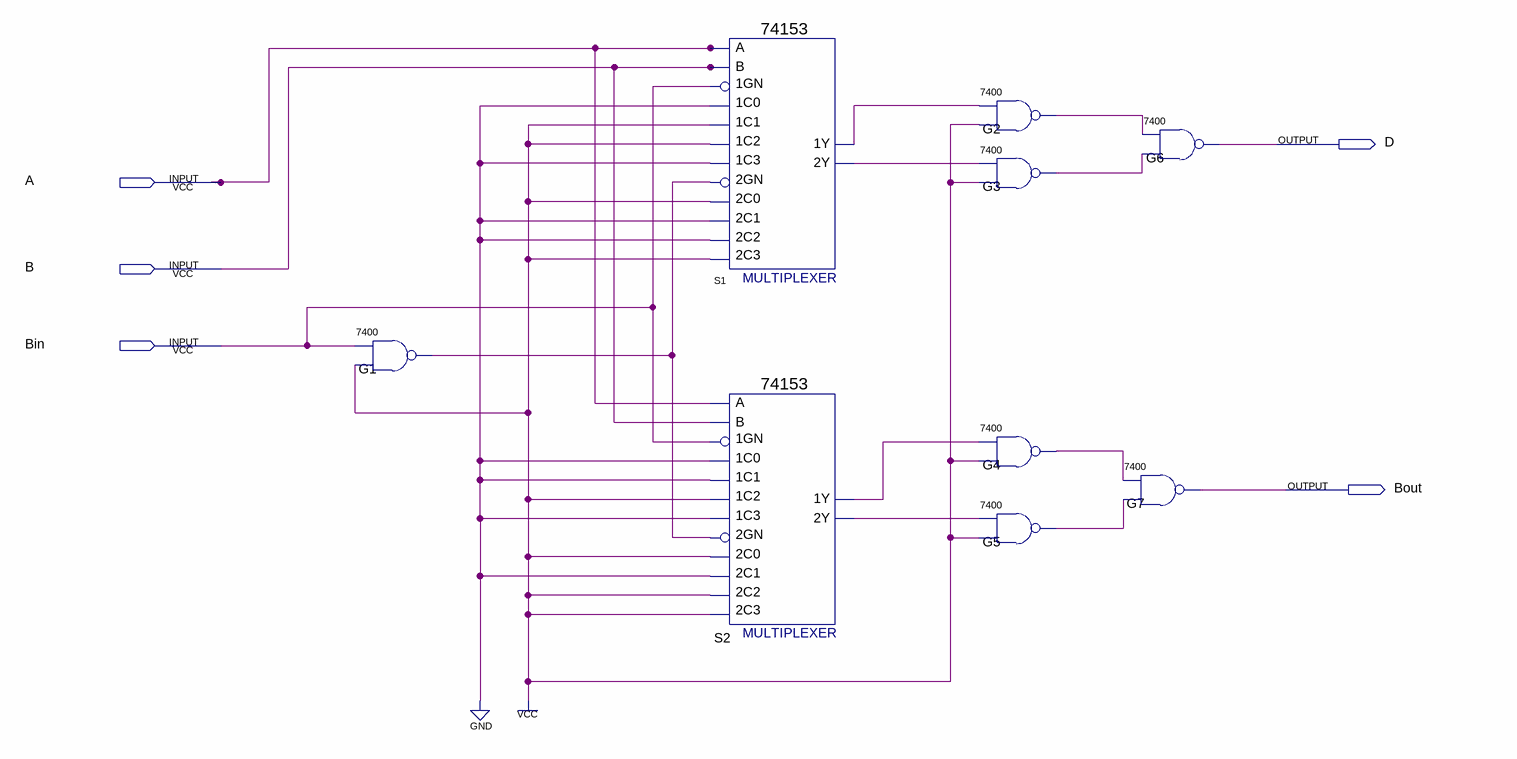
[diagram p0: schematic sheet]
// Quartus schematic 2_2.bdf as structural Verilog: 9 symbols, 5 pins
module \2_2  (
  input  A,
  input  B,
  input  Bin,
  output D,
  output Bout
);

  wire G1_1, G2_1, G3_1, G4_1, G5_1, S1_1y, S1_2y, S2_1y, S2_2y;

  \7400  G1 (.\3 (1'b1), .\2 (Bin), .\1 (G1_1));
  \74153  S1 (
    .\1C1 (1'b1), .\1GN (Bin), .\1C0 (1'b0), .\2C0 (1'b1), .\2GN (G1_1), .\2C2 (1'b0), .\1C2 (1'b1),
    .\1C3 (1'b0), .B(B), .A(A), .\2C1 (1'b0), .\2C3 (1'b1), .\1Y (S1_1y), .\2Y (S1_2y));
  \74153  S2 (
    .\1C1 (1'b0), .\1GN (Bin), .\1C0 (1'b0), .\2C0 (1'b1), .\2GN (G1_1), .\2C2 (1'b1), .\1C2 (1'b1),
    .\1C3 (1'b0), .B(B), .A(A), .\2C1 (1'b0), .\2C3 (1'b1), .\1Y (S2_1y), .\2Y (S2_2y));
  \7400  G2 (.\3 (1'b1), .\2 (S1_1y), .\1 (G2_1));
  \7400  G3 (.\3 (1'b1), .\2 (S1_2y), .\1 (G3_1));
  \7400  G4 (.\3 (1'b1), .\2 (S2_1y), .\1 (G4_1));
  \7400  G5 (.\3 (1'b1), .\2 (S2_2y), .\1 (G5_1));
  \7400  G6 (.\3 (G3_1), .\2 (G2_1), .\1 (D));
  \7400  G7 (.\3 (G5_1), .\2 (G4_1), .\1 (Bout));
endmodule
